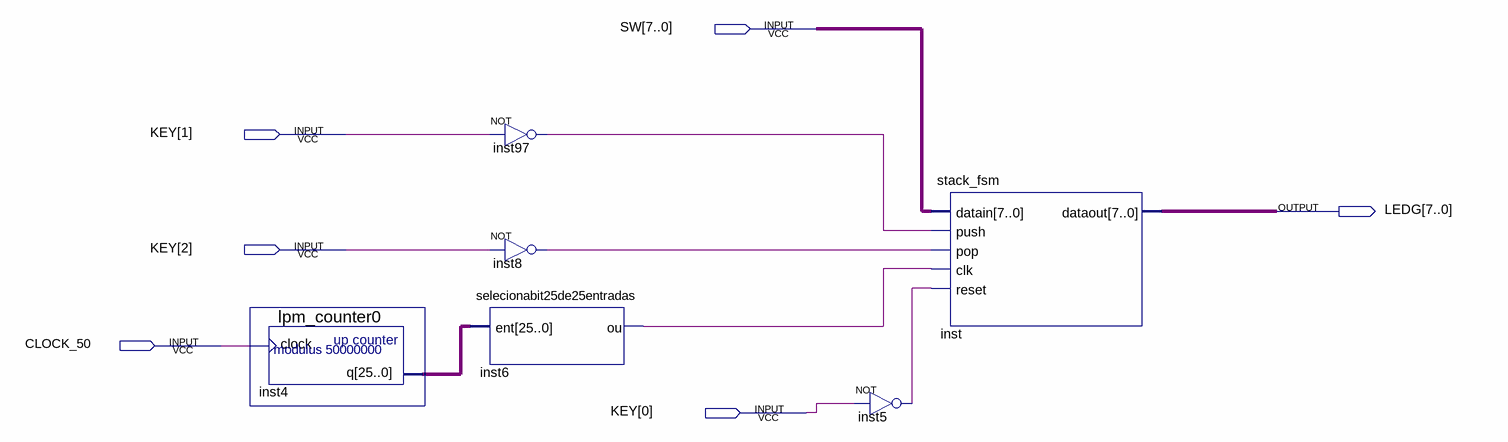
[diagram p0: schematic sheet]
// Quartus schematic stack.bdf as structural Verilog: 6 symbols, 6 pins
module stack (
  input  [7:0] SW,
  input  [2:0] KEY,
  input  CLOCK_50,
  output [7:0] LEDG
);

  wire inst5_out, inst6_ou, inst8_out, inst97_out;
  wire [25:0] inst4_q;

  lpm_counter0 inst4 (.clock(CLOCK_50), .q(inst4_q));
  selecionabit25de25entradas inst6 (.ent(inst4_q), .ou(inst6_ou));
  not inst97 (inst97_out, KEY[1]);
  not inst8 (inst8_out, KEY[2]);
  not inst5 (inst5_out, KEY[0]);
  stack_fsm inst (.datain(SW), .push(inst97_out), .pop(inst8_out), .clk(inst6_ou), .reset(inst5_out), .dataout(LEDG));
endmodule
